# EasyEDA schematic Bravo-M5-Control Logic.json

## Sheets
1 Bravo-M5-Control Logic: TITLE: Bravo V1.0-M5-Control Logic; REV: 1.0; Date: 2021-11-23; Sheet: 1/2; Drawn By: Kaveh Majidi (CONFIG IOI)
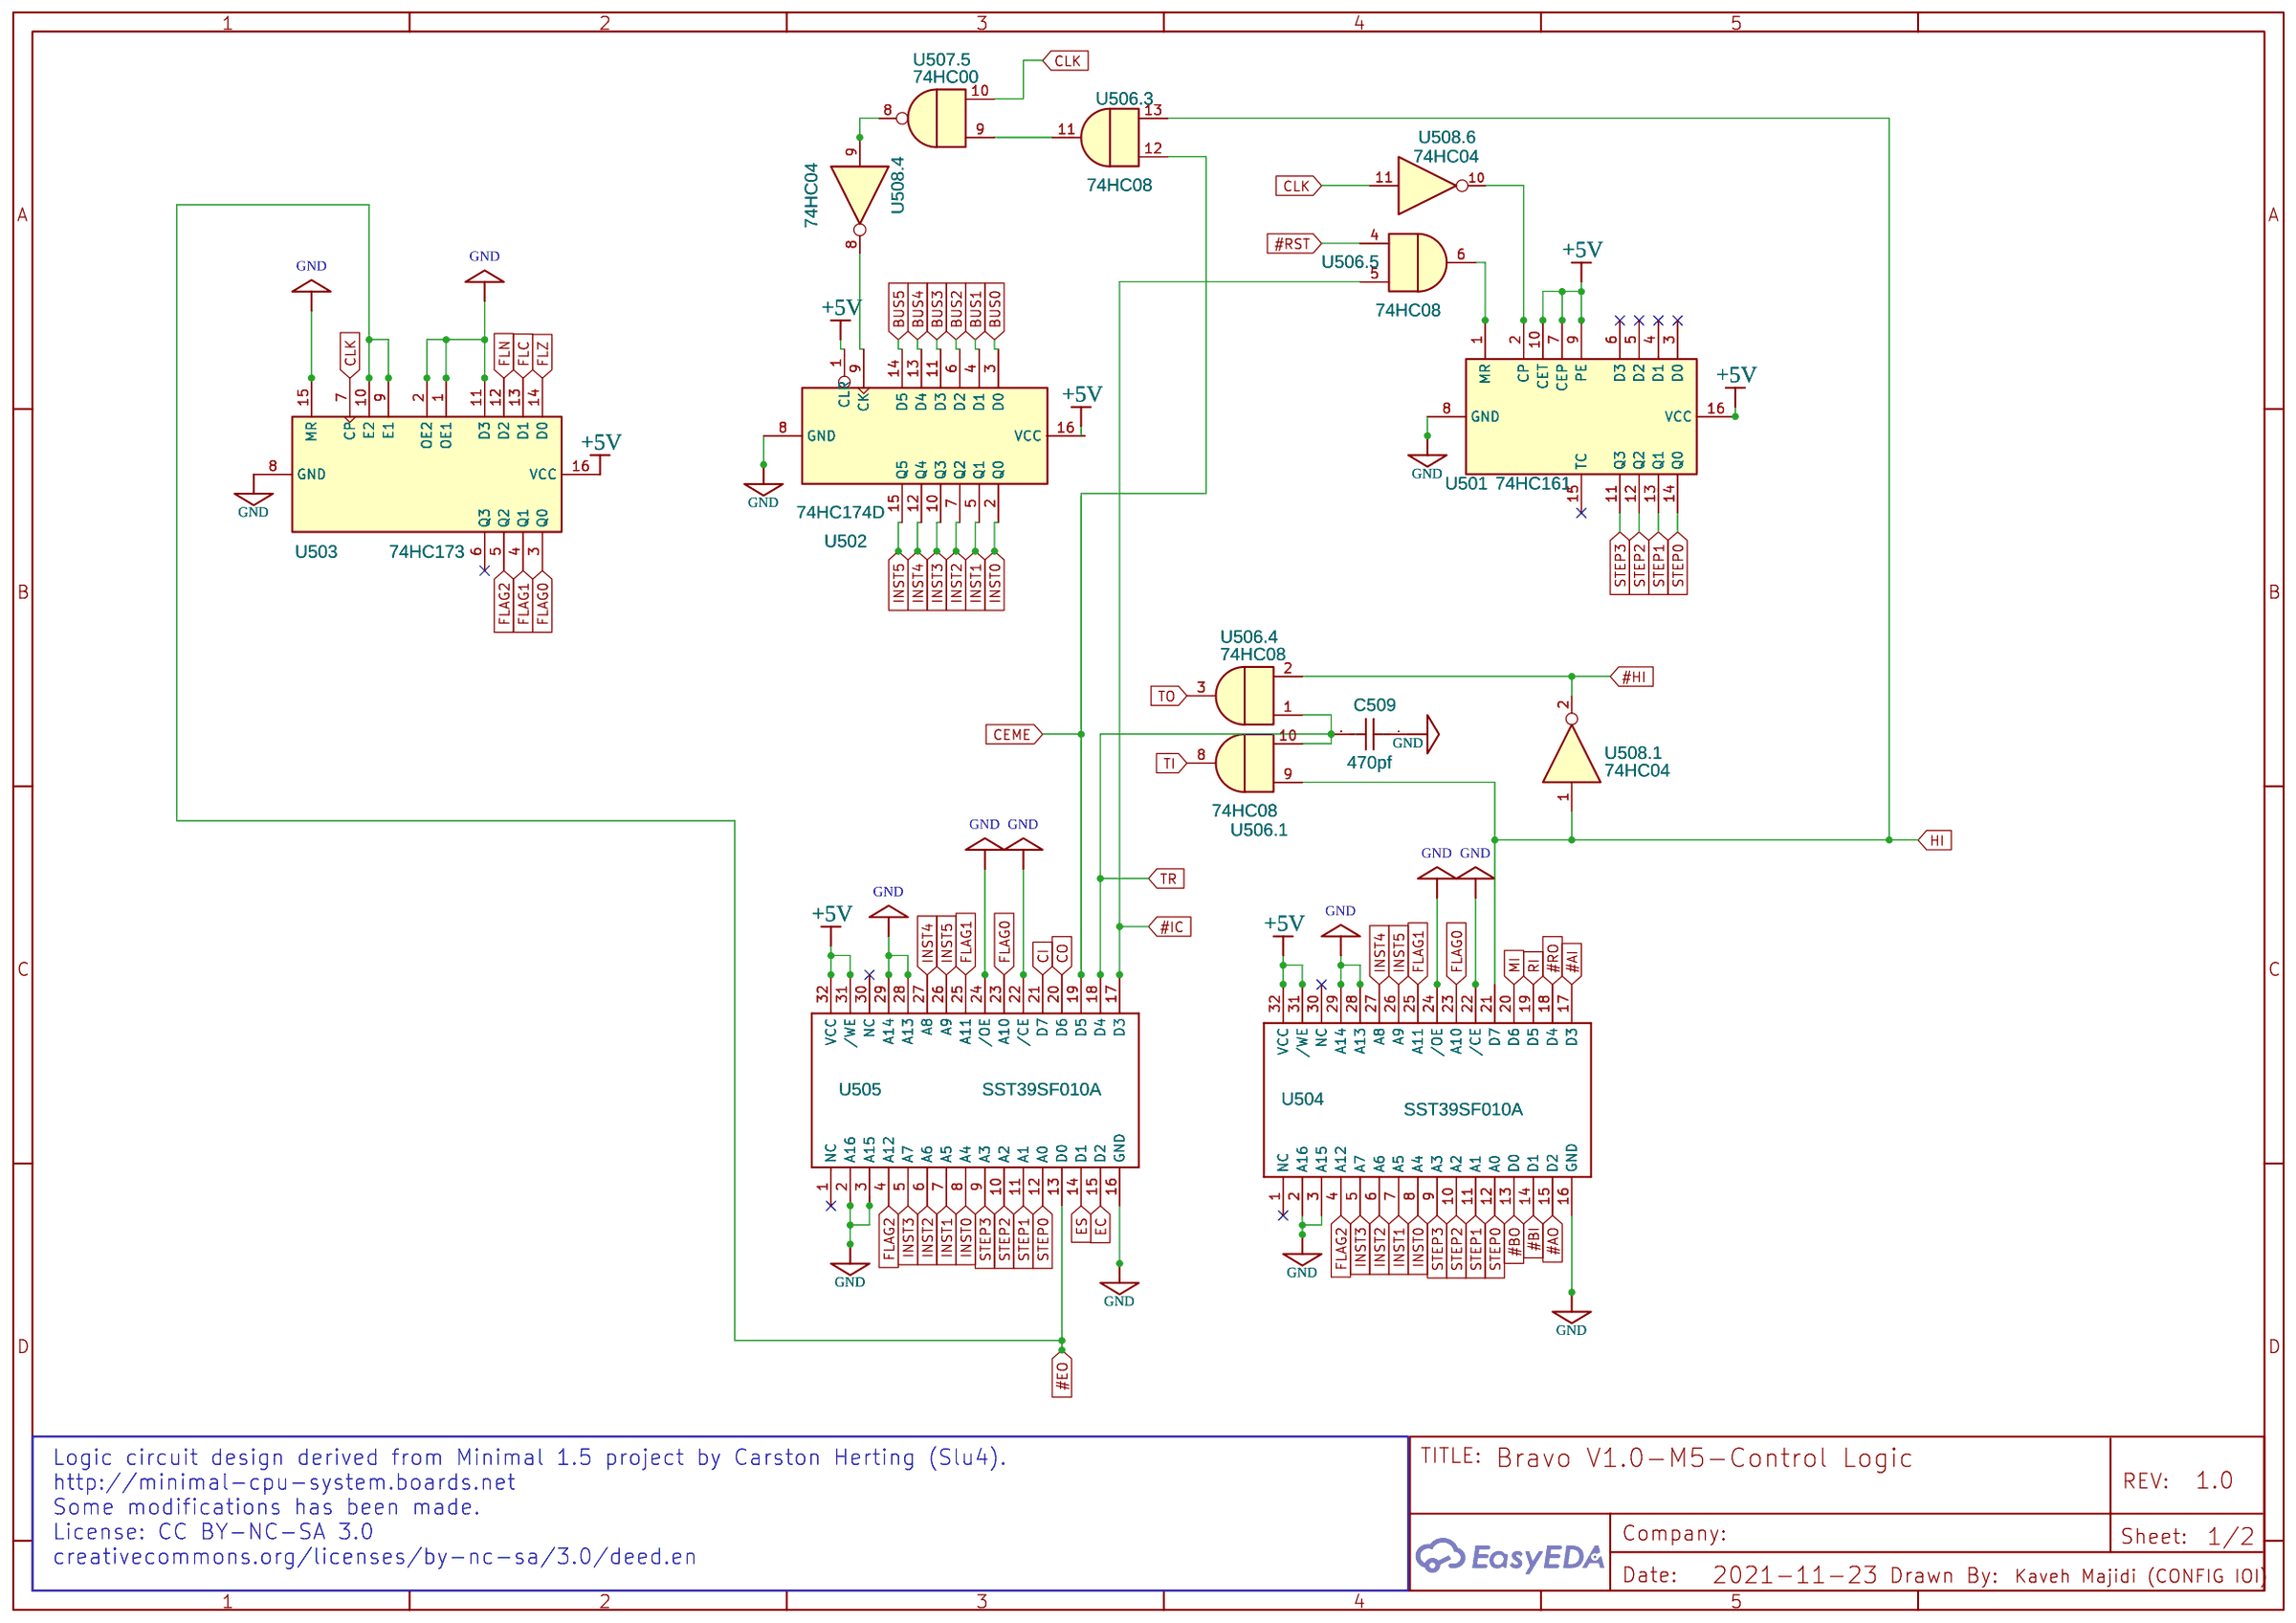
[diagram p0: Bravo-M5-Control Logic]
2 Bravo-M5-Common: TITLE: Bravo V1.0-M5-Common; Sheet: 2/2
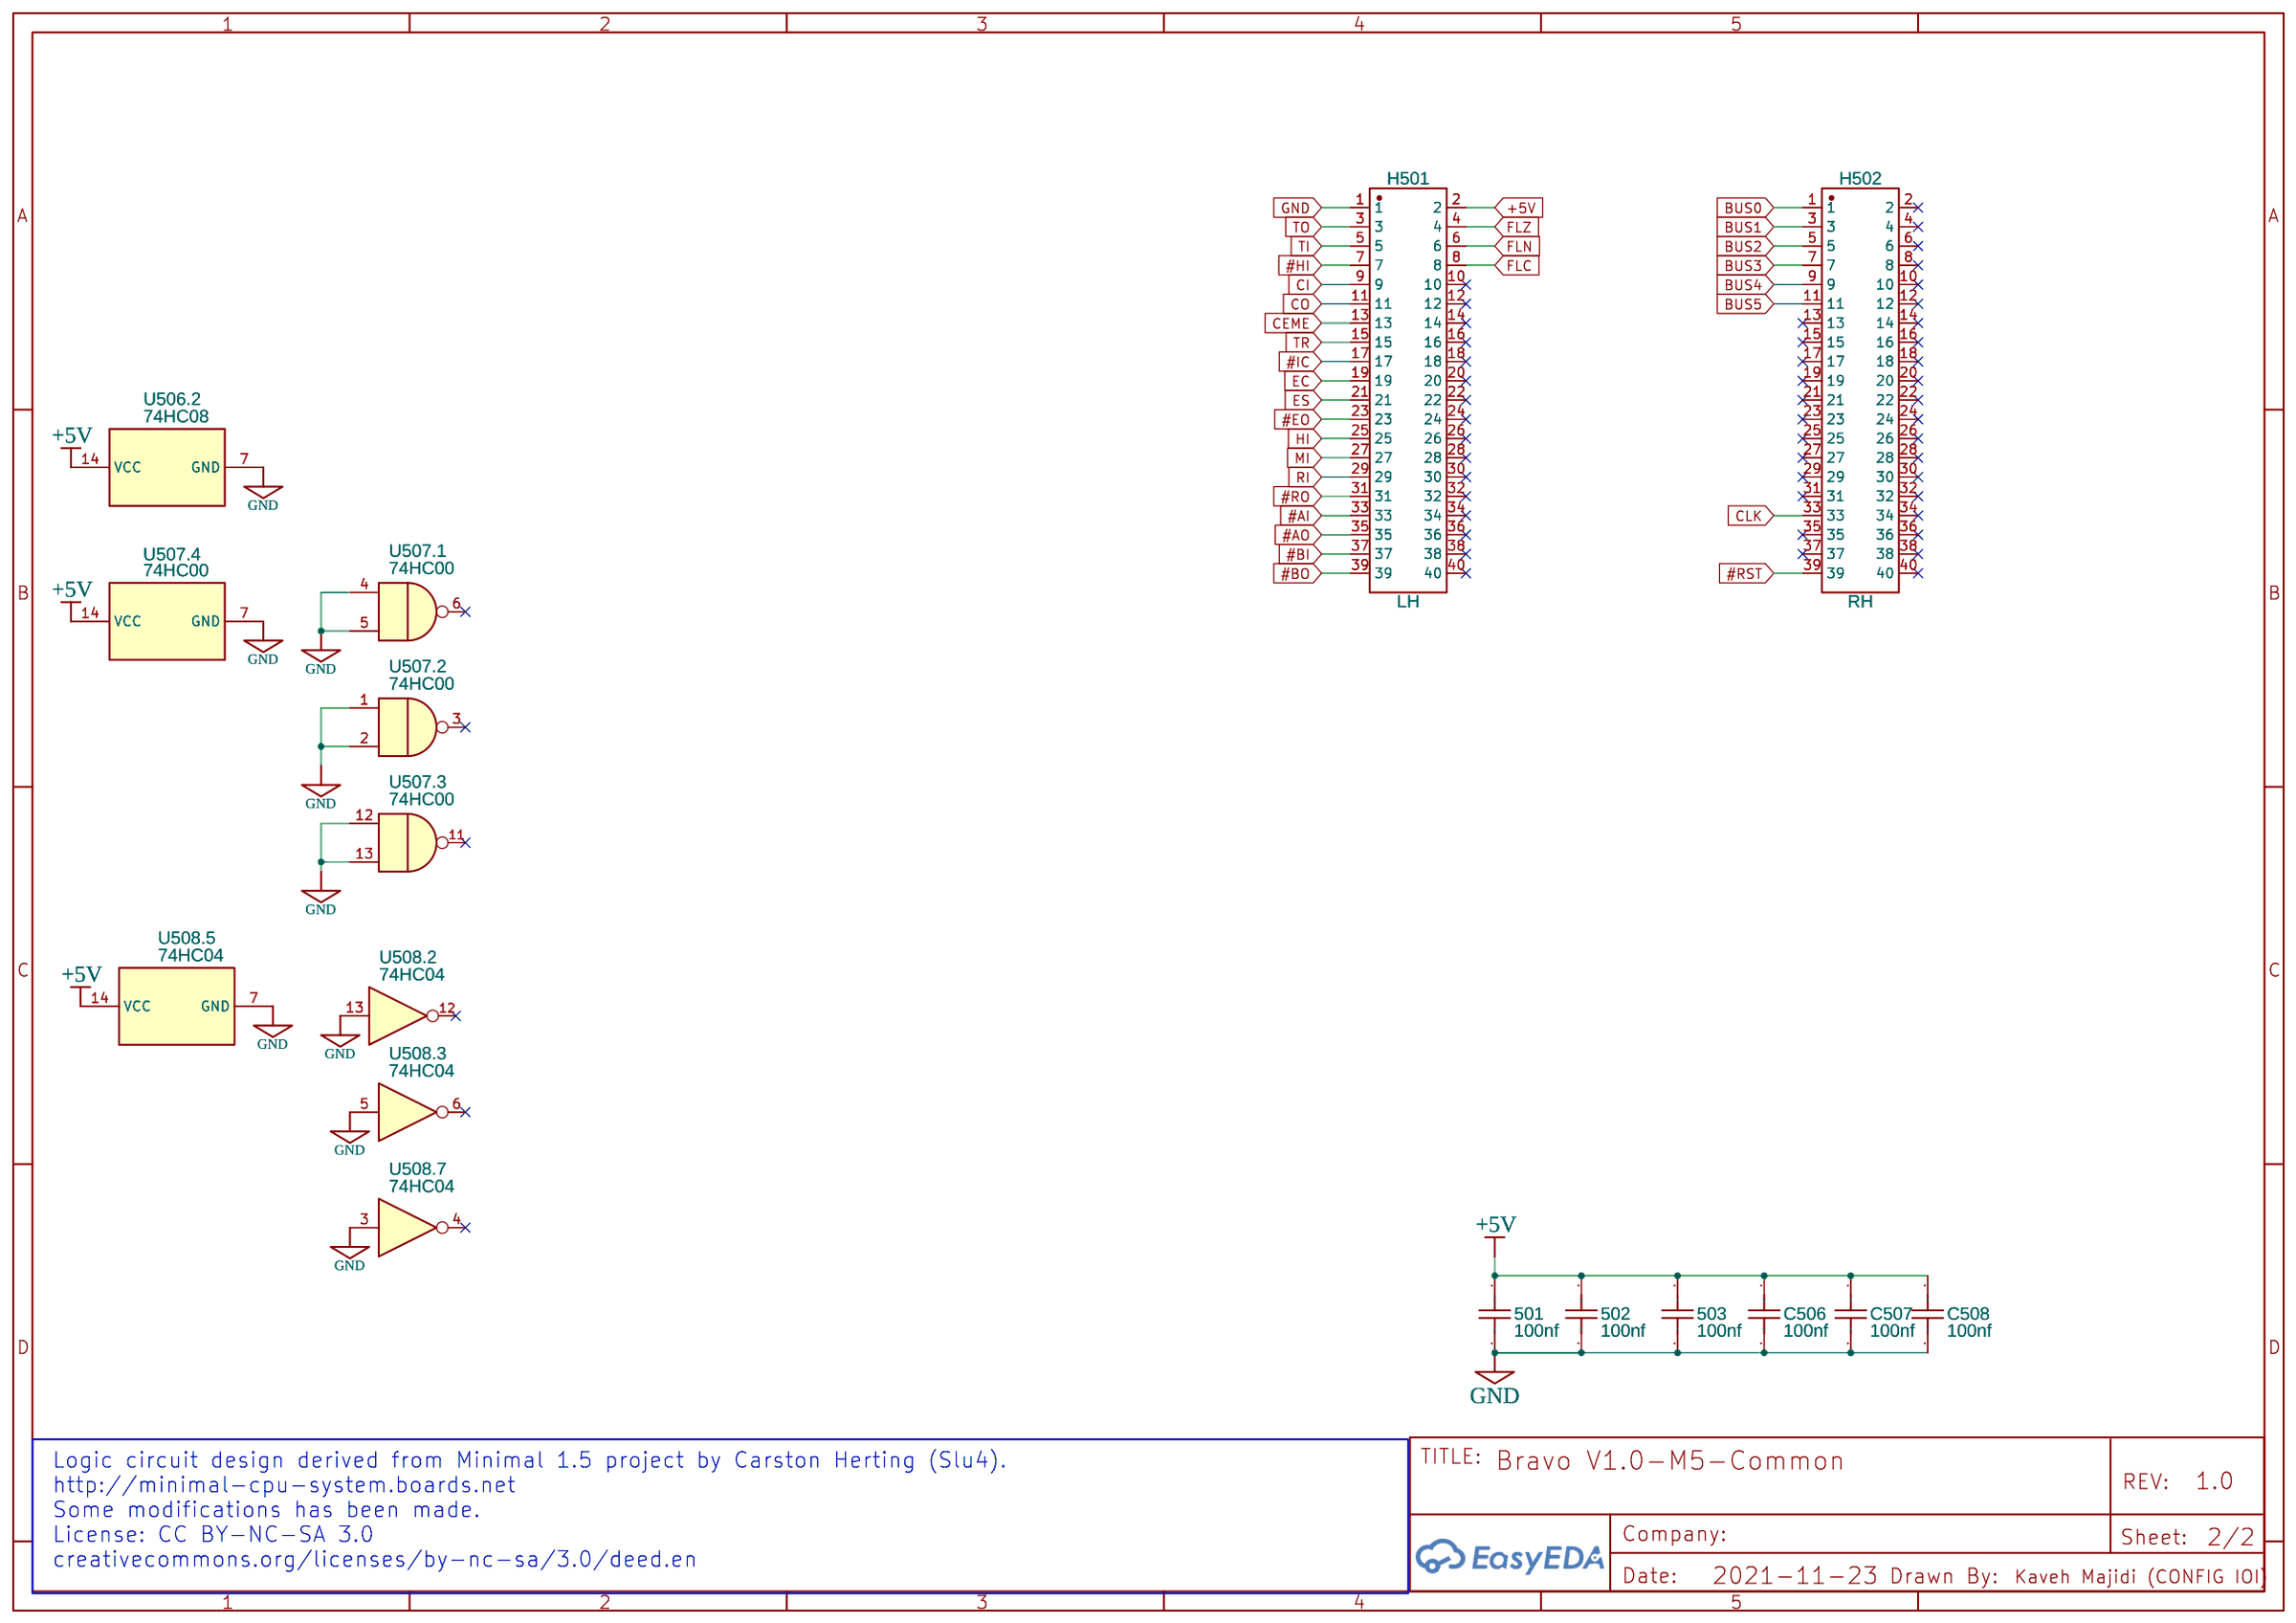
[diagram p1: Bravo-M5-Common]

## Parts
sheet Bravo-M5-Common
501  100nf  [CAP-TH_L4.0-W2.5-P5.00-D1.0]
502  100nf  [CAP-TH_L4.0-W2.5-P5.00-D1.0]
503  100nf  [CAP-TH_L4.0-W2.5-P5.00-D1.0]
C506  100nf  [CAP-TH_L4.0-W2.5-P5.00-D1.0]
C507  100nf  [CAP-TH_L4.0-W2.5-P5.00-D1.0]
C508  100nf  [CAP-TH_L4.0-W2.5-P5.00-D1.0]
H501  LH  [HEADER-2X20-2.54]
H502  RH  [HEADER-2X20-2.54]
U507  74HC00  [DIP-14_W7.62MM_SOCKET]  (sections 1,2,3,4,5)
sheet Bravo-M5-Control Logic
C509  470pf  [CAP-TH_L4.0-W2.5-P5.00-D1.0]
U501  74HC161  [DIP-16_W7.62MM_SOCKET]
U502  74HC174D  [DIP-16_W7.62MM_SOCKET]
U503  74HC173  [DIP-16_W7.62MM_SOCKET]
U504  SST39SF010A  [DIP-32_600MIL]
U505  SST39SF010A  [DIP-32_600MIL]
U506  74HC08  [DIP-14_W7.62MM_SOCKET]  (sections 1,2,3,4,5)
U508  74HC04  [DIP-14_W7.62MM_SOCKET]  (sections 1,2,3,4,5,6,7)

## Library data of the parts
501-503 C506-C509 = CC45SL3AD220JYVNA: Supplier: LCSC; Supplier Part: C342429; Manufacturer: TDK; Contributor: LCSC
H501 H502 = HEADER-2x20-2.54: Manufacturer Part: Headers  Pins2.54mm1*10P; image: http://image.lceda.cn/szlcsc/C57369.jpg; Supplier Part: C57369; Contributor: panasonic-spunt
U507 = 74HC00: Contributor: easyledas; subpart_no: 1
U501 = 74HC161: Contributor: Thiago Mendes
U502 = 74HC174D: Contributor: Ruben Igval
U503 = 74HC173: Contributor: Vadim Bley
U504 U505 = SST39SF010A: Contributor: Malte Dömer
U506 = 74HC08: Contributor: Sirawit Lappisatepun; subpart_no: 1
U508 = 74HC04: Contributor: Daniel_Wareham; subpart_no: 1

## Nets
+5V: 501.1 502.1 503.1 C506.1 C507.1 C508.1 H501.2 U501.7(CEP) U501.9(PE) U501.10(CET) U501.16(VCC) U502.1(CLR) U502.16(VCC) U503.16(VCC) U504.31(/WE) U504.32(VCC) U505.31(/WE) U505.32(VCC) U506.14(VCC) U507.14(VCC) U508.14(VCC)
GND: 501.2 502.2 503.2 C506.2 C507.2 C508.2 C509.1 H501.1 U501.8(GND) U502.8(GND) U503.1(OE1) U503.2(OE2) U503.8(GND) U503.11(D3) U503.15(MR) U504.2(A16) U504.3(A15) U504.16(GND) U504.22(/CE) U504.24(/OE) U504.28(A13) U504.29(A14) U505.2(A16) U505.3(A15) U505.16(GND) U505.22(/CE) U505.24(/OE) U505.28(A13) U505.29(A14) U506.7(GND) U507.1 U507.2 U507.4 U507.5 U507.7(GND) U507.12 U507.13 U508.3 U508.5 U508.7(GND) U508.13
#AI: H501.33 U504.17(D3)
#AO: H501.35 U504.15(D2)
#BI: H501.37 U504.14(D1)
#BO: H501.39 U504.13(D0)
#EO: H501.23 U503.9(E1) U503.10(E2) U505.13(D0)
#HI: H501.7 U506.2 U508.2
#IC: H501.17 U505.17(D3) U506.5
#RO: H501.31 U504.18(D4)
#RST: H502.39 U506.4
BUS0: H502.1 U502.3(D0)
BUS1: H502.3 U502.4(D1)
BUS2: H502.5 U502.6(D2)
BUS3: H502.7 U502.11(D3)
BUS4: H502.9 U502.13(D4)
BUS5: H502.11 U502.14(D5)
CEME: H501.13 U505.19(D5) U506.12
CI: H501.9 U505.21(D7)
CLK: H502.33 U503.7(CP) U507.10 U508.11
CO: H501.11 U505.20(D6)
EC: H501.19 U505.15(D2)
ES: H501.21 U505.14(D1)
FLAG0: U503.3(Q0) U504.23(A10) U505.23(A10)
FLAG1: U503.4(Q1) U504.25(A11) U505.25(A11)
FLAG2: U503.5(Q2) U504.4(A12) U505.4(A12)
FLC: H501.8 U503.13(D1)
FLN: H501.6 U503.12(D2)
FLZ: H501.4 U503.14(D0)
HI: H501.25 U504.21(D7) U506.9 U506.13 U508.1
INST0: U502.2(Q0) U504.8(A4) U505.8(A4)
INST1: U502.5(Q1) U504.7(A5) U505.7(A5)
INST2: U502.7(Q2) U504.6(A6) U505.6(A6)
INST3: U502.10(Q3) U504.5(A7) U505.5(A7)
INST4: U502.12(Q4) U504.27(A8) U505.27(A8)
INST5: U502.15(Q5) U504.26(A9) U505.26(A9)
MI: H501.27 U504.20(D6)
RI: H501.29 U504.19(D5)
STEP0: U501.14(Q0) U504.12(A0) U505.12(A0)
STEP1: U501.13(Q1) U504.11(A1) U505.11(A1)
STEP2: U501.12(Q2) U504.10(A2) U505.10(A2)
STEP3: U501.11(Q3) U504.9(A3) U505.9(A3)
TI: H501.5 U506.8
TO: H501.3 U506.3
TR: C509.2 H501.15 U505.18(D4) U506.1 U506.10
Net-(U501-1): U501.1(MR) U506.6
Net-(U501-2): U501.2(CP) U508.10
Net-(U502-9): U502.9(CK) U508.8
Net-(U506.3-11): U506.11 U507.9
Net-(U507.5-8): U507.8 U508.9

Not connected (* = marked no-connect by the designer): H501 10* 12* 14* 16* 18* 20* 22* 24* 26* 28* 30* 32* 34* 36* 38* 40*; H502 2* 4* 6* 8* 10* 12* 13* 14* 15* 16* 17* 18* 19* 20* 21* 22* 23* 24* 25* 26* 27* 28* 29* 30* 31* 32* 34* 35* 36* 37* 38* 40*; U501 3(D0)* 4(D1)* 5(D2)* 6(D3)* 15(TC)*; U503 6(Q3)*; U504 1(NC)* 30(NC)*; U505 1(NC)* 30(NC)*; U507 3* 6* 11*; U508 4* 6* 12*

## Notes on the sheets
sheet 1
- Logic circuit design derived from Minimal 1.5 project by Carston Herting (Slu4).
  http://minimal-cpu-system.boards.net
  Some modifications has been made.
  License: CC BY-NC-SA 3.0
  creativecommons.org/licenses/by-nc-sa/3.0/deed.en
sheet 2
- Logic circuit design derived from Minimal 1.5 project by Carston Herting (Slu4).
  http://minimal-cpu-system.boards.net
  Some modifications has been made.
  License: CC BY-NC-SA 3.0
  creativecommons.org/licenses/by-nc-sa/3.0/deed.en
